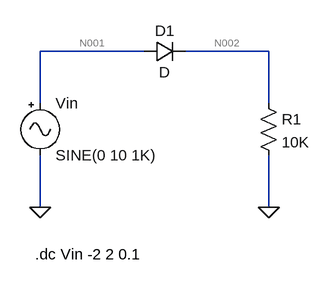
[diagram p0: schematic Prelab 5 - #1a-b.asc]
Prelab 5 - #1a-b.asc, the LTspice schematic file:
Version 4
SHEET 1 880 680
WIRE -160 80 -320 80
WIRE 32 80 -96 80
WIRE -320 160 -320 80
WIRE 32 160 32 80
WIRE -320 320 -320 240
WIRE 32 320 32 240
FLAG -320 320 0
FLAG 32 320 0
SYMBOL diode -160 96 R270
WINDOW 0 32 32 VTop 2
WINDOW 3 0 32 VBottom 2
SYMATTR InstName D1
SYMBOL res 16 144 R0
SYMATTR InstName R1
SYMATTR Value 10K
SYMBOL Misc\\signal -320 144 R0
WINDOW 123 0 0 Left 0
WINDOW 39 0 0 Left 0
SYMATTR InstName Vin
SYMATTR Value SINE(0 10 1K)
TEXT -328 392 Left 2 !.dc Vin -2 2 0.1

The netlist it stands for:
* Prelab 5 - #1a-b.asc
D1 N001 N002 D
R1 N002 0 10K
Vin N001 0 SINE(0 10 1K)
.model D D
.lib standard.dio
.dc Vin -2 2 0.1
.backanno
.end

* Results of the author's LTspice run, read from the files saved beside the schematic
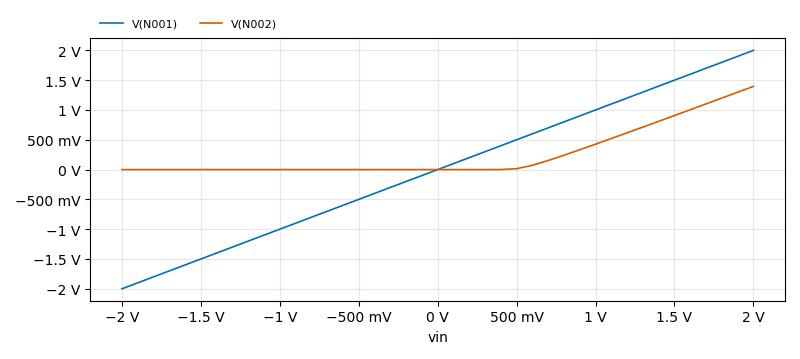
[diagram p1: DC transfer characteristic of Prelab 5 - #1a-b.asc, plotted from the saved traces]
* DC transfer characteristic, 1 run:
*   V(N001): -2 V at vin=-2 V, 2 V at vin=2 V, min -2 V, max 2 V
*   V(N002): -20.1 nV at vin=-2 V, 1.396 V at vin=2 V, min -20.1 nV, max 1.396 V